# Altium project Thermostat_Thorlabs.PrjPCB (part 1 of 2)
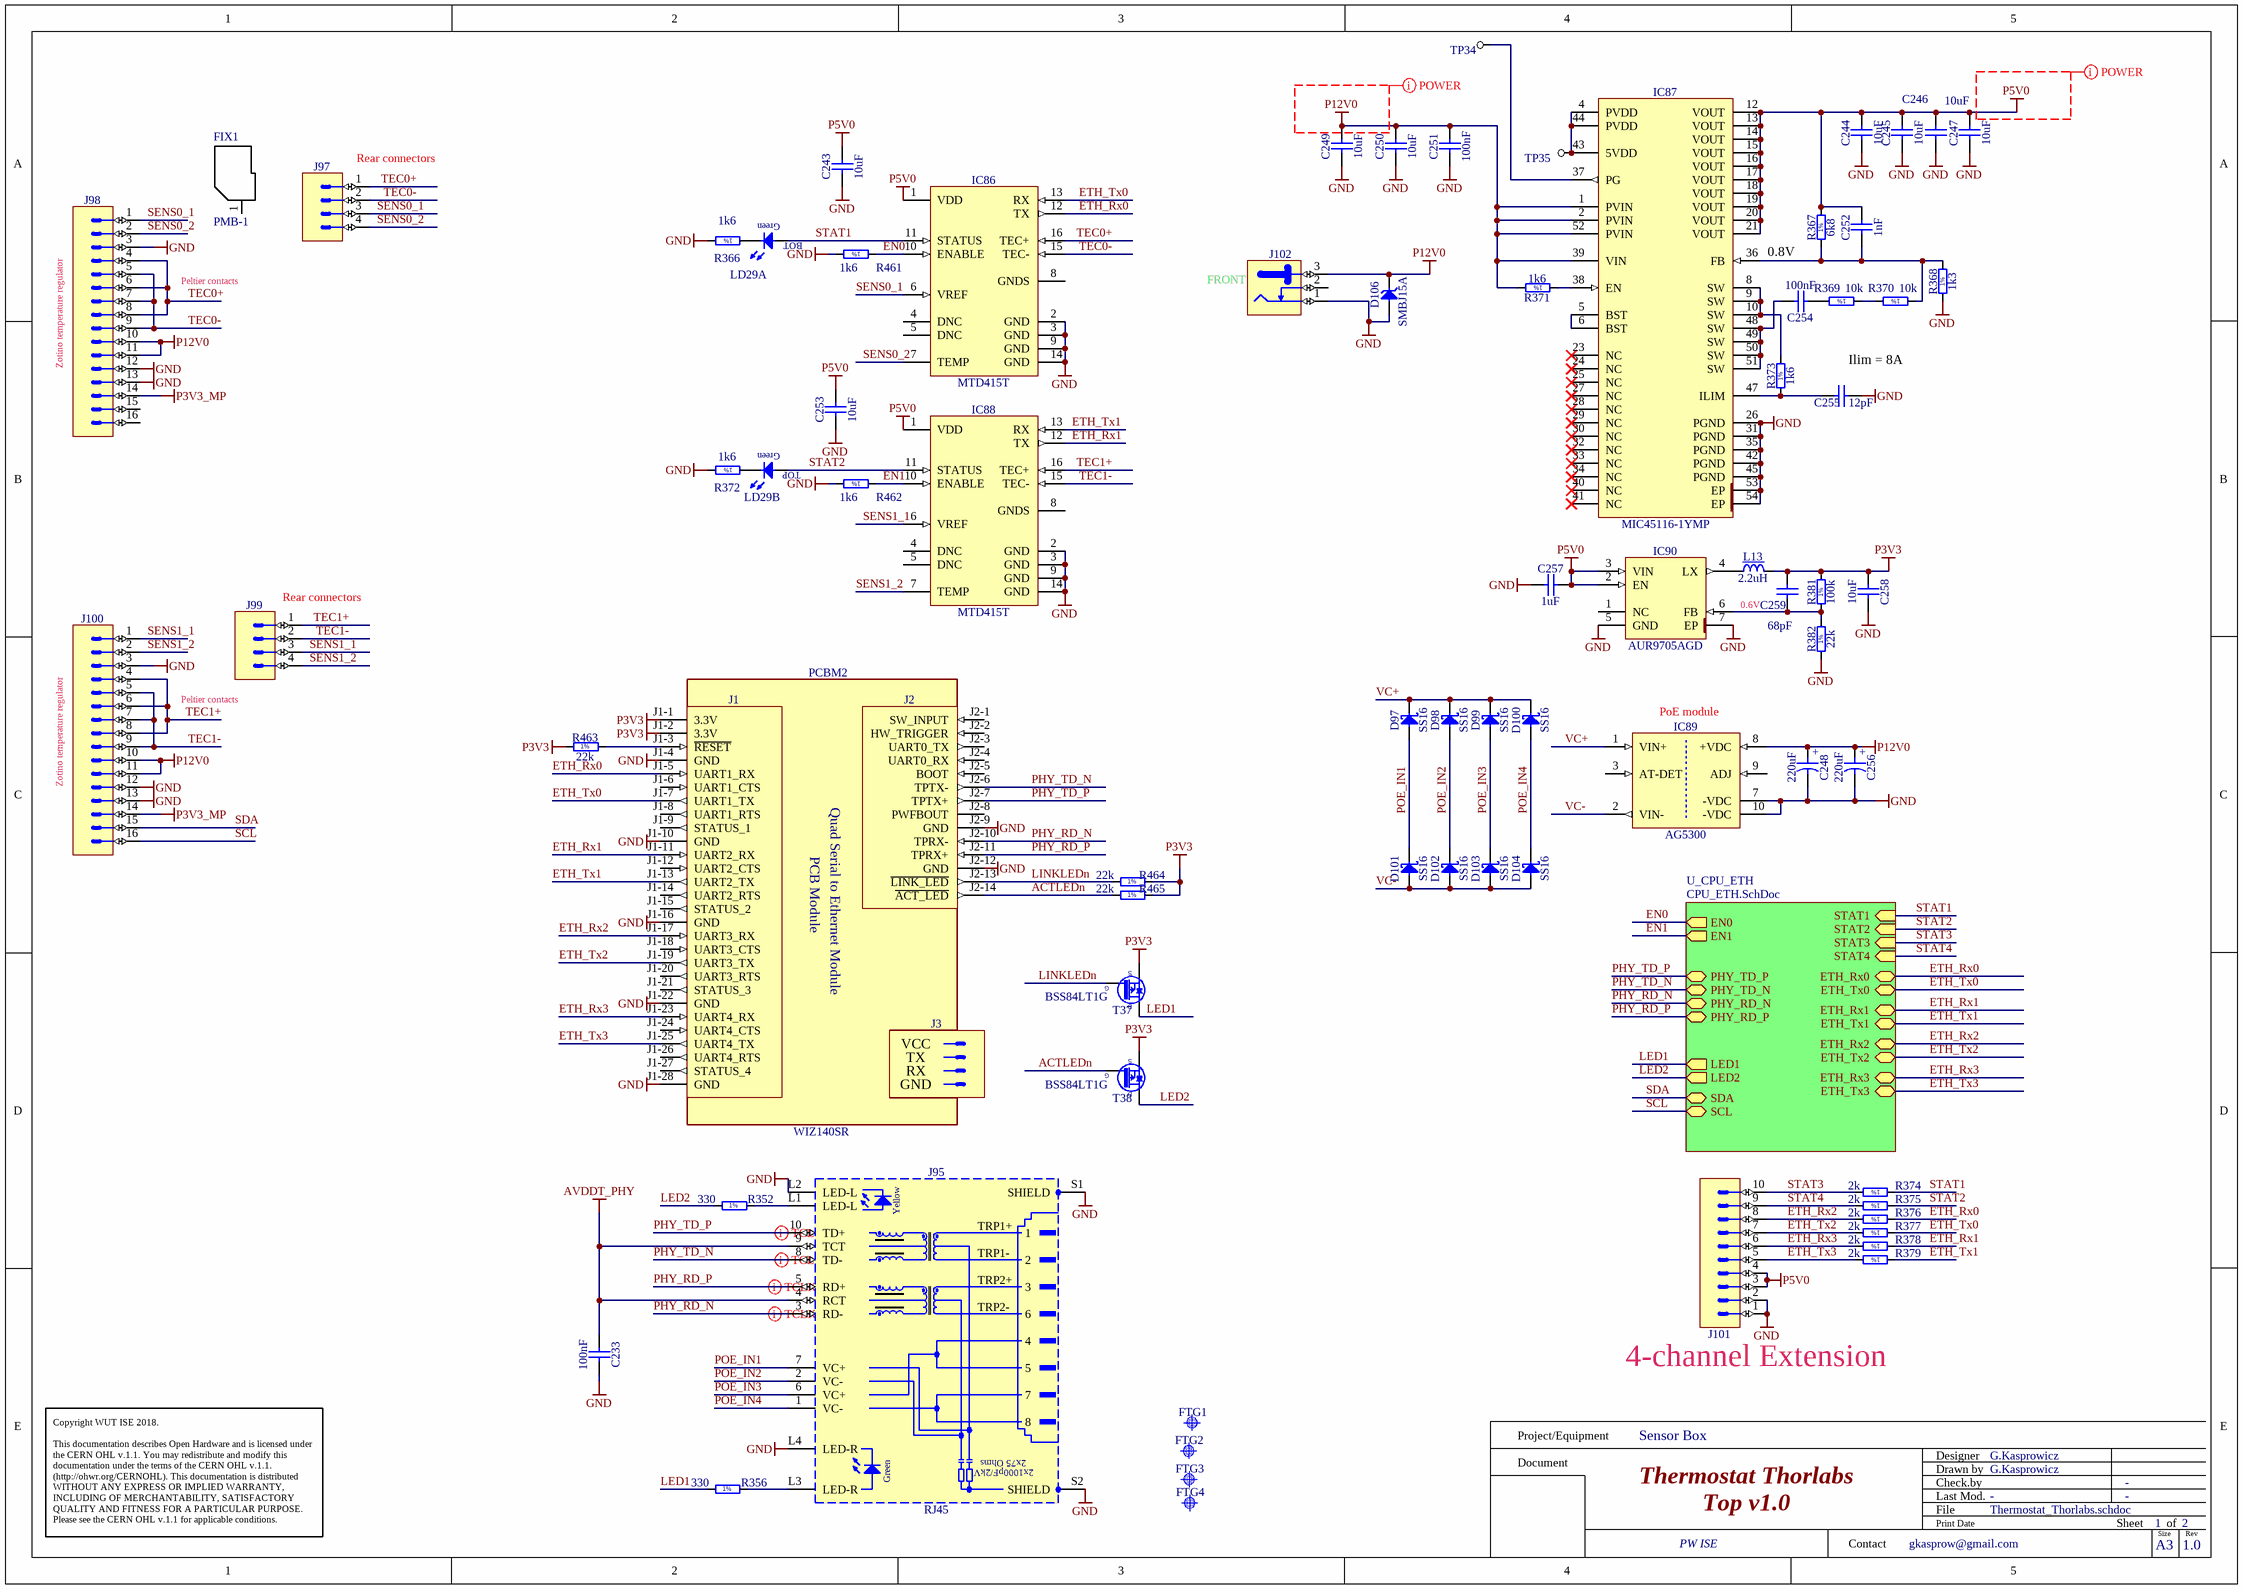
[diagram p0: Thermostat_Thorlabs.schdoc]
2 sheets, 131 parts. Net scope: hierarchical (ports join the sheet entries above them; power ports are global).
Board file: Thermostat_Thorlabs.PCBDOC
Sheets:
  Thermostat_Thorlabs.schdoc
    U_CPU_ETH = CPU_ETH.SchDoc

## Sheet Thermostat_Thorlabs.schdoc: Thermostat Thorlabs
size 420 x 297 mm; EDA_Number: ARTIQ; Projet: Thermostat; Author: G.Kasprowicz; CompanyName: WUT ISE; DrawnBy: G.Kasprowicz; Organization: WUT ISE; Address1: PW ISE; Address2: Nowowiejska 15/19 00-665 Warsaw; Address3: gkasprow@gmail.com; DocumentNumber: 1; Revision: 1.0; SheetNumber: 1; SheetTotal: 2; ModifiedBy: -; CheckedDate: -; Title2: Top v1.0; DivGrp: WUT ISE; Designer: G.Kasprowicz; ModifiedDate: -; ProjectName: Sensor Box

### Parts
C233  100nF  [CAPC1005X55N]
C243  10uF  [CAPC2012X135N]
C244  10uF  [CAPC2012X135N]
C245  10uF  [CAPC2012X135N]
C246  10uF  [CAPC2012X135N]
C247  10uF  [CAPC2012X135N]
C248  220uF  [CAPMP7343X430N]
C249  10uF  [CAPC2012X135N]
C250  10uF  [CAPC2012X135N]
C251  100nF  [CAPC1005X55N]
C252  1nF  [CAPC1608X87N]
C253  10uF  [CAPC2012X135N]
C254  100nF  [CAPC1005X55N]
C255  12pF  [CAPC1005X55N]
C256  220uF  [CAPMP7343X430N]
C257  1uF  [CAPC1005X55N]
C258  10uF  [CAPC2012X135N]
C259  68pF  [CAPC1608X87N]
D97  SS16  [DIOM5127X229N]
D98  SS16  [DIOM5127X229N]
D99  SS16  [DIOM5127X229N]
D100  SS16  [DIOM5127X229N]
D101  SS16  [DIOM5127X229N]
D102  SS16  [DIOM5127X229N]
D103  SS16  [DIOM5127X229N]
D104  SS16  [DIOM5127X229N]
D106  SMBJ15A  [DIOM5336X265N]
FIX1  PMB-1  [PMB-1]
FTG1  Use only in PCB  [FIDUCIAL_TOP_C100-200]  (value not drawn)
FTG2  Use only in PCB  [FIDUCIAL_TOP_S100-200]  (value not drawn)
FTG3  Use only in PCB  [FIDUCIAL_TOP_S200-400]  (value not drawn)
FTG4  Use only in PCB  [FIDUCIAL_TOP_S100-200]  (value not drawn)
IC86  MTD415T  [THORLABS_MTD415T]
IC87  MIC45116-1YMP  [MICROCHIP_H3QFN88-52LD-PL-3]
IC88  MTD415T  [THORLABS_MTD415T]
IC89  AG5300  [SILVERTEL_AG5300]
IC90  AUR9705AGD  [SON65P200X200X80-7N-R65X145]
J95  RJ45  [ABRACON_ARJM11C7-114-BA-EW2]
J97  (no value)  [FCI_20020110-D041A01LF]
J98  Header 16  [3M_N2516-6002RB]  (value not drawn)
J99  (no value)  [FCI_20020110-D041A01LF]
J100  Header 16  [3M_N2516-6002RB]  (value not drawn)
J101  Header 10  [3M_N2510-6002RB]  (value not drawn)
J102  Jack  [SWITCHCRAFT_L712RA]  (value not drawn)
L13  2.2uH  [IND_MURATA_LQH44PN_P0]
LD29  Green/Green  [LED_DIALIGHT_571-0122F]  (value not drawn)  (parts A,B of 2)
PCBM2  WIZ140SR  [PCBM_WIZNET_WIZ140SR_a]
R352  330  [RESC1005X40N]
R356  330  [RESC1005X40N]
R366  1k6  [RESC1005X40N]
R367  6k8  [RESC1005X40N]
R368  1k3  [RESC1608X55N]
R369  10k  [RESC1005X40N]
R370  10k  [RESC1005X40N]
R371  1k6  [RESC1005X40N]
R372  1k6  [RESC1005X40N]
R373  1k6  [RESC1005X40N]
R374  2k  [RESC1005X40N]
R375  2k  [RESC1005X40N]
R376  2k  [RESC1005X40N]
R377  2k  [RESC1005X40N]
R378  2k  [RESC1005X40N]
R379  2k  [RESC1005X40N]
R381  100k  [RESC1005X40N]
R382  22k  [RESC1005X40N]
R461  1k6  [RESC1005X40N]
R462  1k6  [RESC1005X40N]
R463  22k  [RESC1005X40N]
R464  22k  [RESC1005X40N]
R465  22k  [RESC1005X40N]
T37  BSS84LT1G  [SOT95P240X110-3N]
T38  BSS84LT1G  [SOT95P240X110-3N]
TP34  TP  [TP]  (value not drawn)
TP35  TP  [TP]  (value not drawn)

### Sub-sheets
U_CPU_ETH = CPU_ETH.SchDoc: PHY_TD_P (bidir), PHY_TD_N (bidir), PHY_RD_N (bidir), PHY_RD_P (bidir), STAT1 (in), STAT2 (in), ETH_Rx1 (bidir), ETH_Tx1 (bidir), ETH_Rx2 (bidir), ETH_Tx2 (bidir), ETH_Rx3 (bidir), ETH_Tx3 (bidir), STAT3 (in), STAT4 (in), LED1 (out), LED2 (out), EN0 (out), EN1 (out), SDA (bidir), SCL (bidir), ETH_Rx0 (bidir), ETH_Tx0 (bidir)

### Nets
AVDDT_PHY: C233.2 J95.4(RCT) J95.9(TCT)
GND: C233.1 C243.1 C244.1 C245.1 C246.1 C247.1 C248.2 C249.1 C250.1 C251.1 C253.1 C255.1 C256.2 C257.1 C258.2 D106.2(A) IC86.2(GND) IC86.3(GND) IC86.9(GND) IC86.14(GND) IC87.26(PGND) IC87.31(PGND) IC87.35(PGND) IC87.42(PGND) IC87.45(PGND) IC87.53(EP) IC87.54(EP) IC88.2(GND) IC88.3(GND) IC88.9(GND) IC88.14(GND) IC89.7(-VDC) IC89.10(-VDC) IC90.5(GND) IC90.7(EP) J95.L2(LED-L) J95.L4(LED-R) J95.S1(SHIELD) J95.S2(SHIELD) J98.3 J98.12 J98.13 J100.3 J100.12 J100.13 J101.1 J101.2 J102.1 PCBM2.J1-4(GND) PCBM2.J1-10(GND) PCBM2.J1-16(GND) PCBM2.J1-22(GND) PCBM2.J1-28(GND) PCBM2.J2-9(GND) PCBM2.J2-12(GND) R366.2 R368.1 R372.2 R382.1 R461.2 R462.2
P3V3: C258.1 C259.2 L13.2 PCBM2.J1-1(3.3V) PCBM2.J1-2(3.3V) R381.2 R463.1 R464.2 R465.2 T37.2(S) T38.2(S)
P3V3_MP: J98.14 J100.14
P5V0: C243.2 C244.2 C245.2 C246.2 C247.2 C252.2 C253.2 C257.2 IC86.1(VDD) IC87.12(VOUT) IC87.13(VOUT) IC87.14(VOUT) IC87.15(VOUT) IC87.16(VOUT) IC87.17(VOUT) IC87.18(VOUT) IC87.19(VOUT) IC87.20(VOUT) IC87.21(VOUT) IC88.1(VDD) IC90.2(EN) IC90.3(VIN) J101.3 J101.4 R367.2
P12V0: C248.1 C249.2 C250.2 C251.2 C256.1 D106.1(C) IC87.1(PVIN) IC87.2(PVIN) IC87.39(VIN) IC87.52(PVIN) IC89.8(+VDC) J98.10 J98.11 J100.10 J100.11 J102.3 R371.2
ACTLEDn: PCBM2.J2-14(~{ACT_LED}) R465.1 T38.1(G)
EN0: IC86.10(ENABLE) R461.1 ; sheet U_CPU_ETH/EN0
EN1: IC88.10(ENABLE) R462.1 ; sheet U_CPU_ETH/EN1
ETH_Rx0: IC86.12(TX) PCBM2.J1-5(UART1_RX) R376.1 ; sheet U_CPU_ETH/ETH_Rx0
ETH_Rx1: IC88.12(TX) PCBM2.J1-11(UART2_RX) R378.1 ; sheet U_CPU_ETH/ETH_Rx1
ETH_Rx2: J101.8 PCBM2.J1-17(UART3_RX) R376.2 ; sheet U_CPU_ETH/ETH_Rx2
ETH_Rx3: J101.6 PCBM2.J1-23(UART4_RX) R378.2 ; sheet U_CPU_ETH/ETH_Rx3
ETH_Tx0: IC86.13(RX) PCBM2.J1-7(UART1_TX) R377.1 ; sheet U_CPU_ETH/ETH_Tx0
ETH_Tx1: IC88.13(RX) PCBM2.J1-13(UART2_TX) R379.1 ; sheet U_CPU_ETH/ETH_Tx1
ETH_Tx2: J101.7 PCBM2.J1-19(UART3_TX) R377.2 ; sheet U_CPU_ETH/ETH_Tx2
ETH_Tx3: J101.5 PCBM2.J1-25(UART4_TX) R379.2 ; sheet U_CPU_ETH/ETH_Tx3
LED1: R356.1 T37.3(D) ; sheet U_CPU_ETH/LED1
LED2: R352.1 T38.3(D) ; sheet U_CPU_ETH/LED2
LINKLEDn: PCBM2.J2-13(~{LINK_LED}) R464.1 T37.1(G)
PHY_RD_N: J95.3(RD-) PCBM2.J2-10(TPRX-) ; sheet U_CPU_ETH/PHY_RD_N
PHY_RD_P: J95.5(RD+) PCBM2.J2-11(TPRX+) ; sheet U_CPU_ETH/PHY_RD_P
PHY_TD_N: J95.8(TD-) PCBM2.J2-6(TPTX-) ; sheet U_CPU_ETH/PHY_TD_N
PHY_TD_P: J95.10(TD+) PCBM2.J2-7(TPTX+) ; sheet U_CPU_ETH/PHY_TD_P
POE_IN1: D97.2(A) D101.1(C) J95.7(VC+)
POE_IN2: D98.2(A) D102.1(C) J95.2(VC-)
POE_IN3: D99.2(A) D103.1(C) J95.6(VC+)
POE_IN4: D100.2(A) D104.1(C) J95.1(VC-)
SCL: J100.16 ; sheet U_CPU_ETH/SCL
SDA: J100.15 ; sheet U_CPU_ETH/SDA
SENS0_1: IC86.6(VREF) J97.3 J98.1
SENS0_2: IC86.7(TEMP) J97.4 J98.2
SENS1_1: IC88.6(VREF) J99.3 J100.1
SENS1_2: IC88.7(TEMP) J99.4 J100.2
STAT1: IC86.11(STATUS) LD29.2(A) R374.1 ; sheet U_CPU_ETH/STAT1
STAT2: IC88.11(STATUS) LD29.4(A) R375.1 ; sheet U_CPU_ETH/STAT2
STAT3: J101.10 R374.2 ; sheet U_CPU_ETH/STAT3
STAT4: J101.9 R375.2 ; sheet U_CPU_ETH/STAT4
TEC0+: IC86.16(TEC+) J97.1 J98.4 J98.6 J98.8
TEC0-: IC86.15(TEC-) J97.2 J98.5 J98.7 J98.9
TEC1+: IC88.16(TEC+) J99.1 J100.4 J100.6 J100.8
TEC1-: IC88.15(TEC-) J99.2 J100.5 J100.7 J100.9
VC+: D97.1(C) D98.1(C) D99.1(C) D100.1(C) IC89.1(VIN+)
VC-: D101.2(A) D102.2(A) D103.2(A) D104.2(A) IC89.2(VIN-)
NetC252_1: C252.1 IC87.36(FB) R367.1 R368.2 R370.1
NetC254_1: C254.1 R369.2
NetC254_2: C254.2 IC87.48(SW) IC87.49(SW) IC87.50(SW) IC87.51(SW)
NetC255_2: C255.2 IC87.47(ILIM) R373.1
NetC259_1: C259.1 IC90.6(FB) R381.1 R382.2
NetIC87_4: IC87.4(PVDD) IC87.43(5VDD) IC87.44(PVDD) TP35.1
NetIC87_5: IC87.5(BST) IC87.6(BST)
NetIC87_8: IC87.8(SW) IC87.9(SW) IC87.10(SW) R373.2
NetIC87_37: IC87.37(PG) TP34.1
NetIC87_38: IC87.38(EN) R371.1
NetIC90_4: IC90.4(LX) L13.1
NetJ95_L1: J95.L1(LED-L) R352.2
NetJ95_L3: J95.L3(LED-R) R356.2
NetLD29_1: LD29.1(C) R366.1
NetLD29_3: LD29.3(C) R372.1
NetPCBM2_J1-3: PCBM2.J1-3(~{RESET}) R463.2
NetR369_1: R369.1 R370.2

Not connected (* = marked no-connect by the designer): FIX1 1; IC86 4(DNC) 5(DNC) 8(GNDS); IC87 23(NC)* 24(NC)* 25(NC)* 27(NC)* 28(NC)* 29(NC)* 30(NC)* 32(NC)* 33(NC)* 34(NC)* 40(NC)* 41(NC)*; IC88 4(DNC) 5(DNC) 8(GNDS); IC89 3(AT-DET) 9(ADJ); IC90 1(NC); J98 15 16; J102 2; PCBM2 J1-6(UART1_CTS) J1-8(UART1_RTS) J1-9(STATUS_1) J1-12(UART2_CTS) J1-14(UART2_RTS) J1-15(STATUS_2) J1-18(UART3_CTS) J1-20(UART3_RTS) J1-21(STATUS_3) J1-24(UART4_CTS) J1-26(UART4_RTS) J1-27(STATUS_4) J2-1(SW_INPUT) J2-2(HW_TRIGGER) J2-3(UART0_TX) J2-4(UART0_RX) J2-5(BOOT) J2-8(PWFBOUT)

### Layout directives
net class POWER: P5V0, P12V0
differential pair: PHY_RD_N, PHY_RD_P, PHY_TD_N, PHY_TD_P

### Notes on the sheet
- (near J97) Rear connectors
- 0.8V
- Peltier contacts
- FRONT
- (near J98) Zotino temperature regulator
- (near C255) Ilim = 8A
- (near J99) Rear connectors
- 0.6V
- (near J99) Peltier contacts
- (near IC89) PoE module
- (near J100) Zotino temperature regulator
- (near J101) 4-channel Extension
- Project/Equipment
- Document
- Designer
- Drawn by
- Check.by
- Copyright WUT ISE 2018.
  This documentation describes Open Hardware and is licensed under the CERN OHL v.1.1. You may redistribute and modify this documentation under the terms of the CERN OHL v.1.1. (http://ohwr.org/CERNOHL). This documentation is distributed WITHOUT ANY EXPRESS OR IMPLIED WARRANTY, INCLUDING OF MERCHANTABILITY, SATISFACTORY QUALITY AND FITNESS FOR A PARTICULAR PURPOSE. Please see the CERN OHL v.1.1 for applicable conditions.
- Contact
- File
- Last Mod.
- Print Date
- Sheet
- Size
- A3
- of
- Rev
- (in symbol CON_ETH_POE_ARJM11C7) Yellow; TRP1+; TRP1-; TRP2+; TRP2-; 2x75 Ohms; Green; 2x1000pF/2kV
- (in symbol CTE7343-43_220UF_16V_10%) +
- (in symbol LED_DIALIGHT_571-0122F, part A) Green; BOT
- (in symbol LED_DIALIGHT_571-0122F, part B) Green; TOP
- (in symbol PCBM_WIZNET_WIZ140SR_a) J1; J2; PCB Module; Quad Serial to Ethernet Module; J3; VCC; TX; RX
- (in symbol R0402_1K6_1%_0.0625W_100PPM) 1%
- (in symbol R0402_2K_1%_0.0625W_100PPM) 1%
- (in symbol R0402_6K8_1%_0.0625W_100PPM) 1%
- (in symbol R0402_10K_1%_0.0625W_100PPM) 1%
- (in symbol R0402_22K_1%_0.0625W_100PPM) 1%
- (in symbol R0402_100K_1%_0.0625W_100PPM) 1%
- (in symbol R0402_330R_1%_0.0625W_100PPM) 1%
- (in symbol R0603_1K3_1%_0.1W_100PPM) 1%

### Library data of the parts
C233 = CC0402_100NF_16V_10%_X5R: Non-polarised capacitor; Part Description: SMD Multilayer Chip Ceramic Capacitor; Manufacturer: GENERIC; Manufacturer1 Part Number: GRM155R61C104KA88D; Voltage: 16V; TC: X5R; Tolerance: ±10%; Part Number: CC0402_100NF_16V_10%_X5R; Component Kind: Standard; Component Type: Standard; Pin Count: 2; Value: 100nF; Status: None; Manufacturer Part Number: CC0402_100NF_16V_10%_X5R; Case: 0402; Mounted: Yes; Socket: No; SMD: Yes; Manufacturer1 Example: MURATA; Manufacturer1 ComponentHeight: 0.55mm; HelpURL: \\cern.ch\dfs\Applications\Altium\Datasheets\CC0402_X5R_MURATA_GRM.pdf; Author: CERN DEM JLC; CreateDate: 10.12.2013; LatestRevisionDate: 10.12.2013; Sense: No
C243-C247 C249 C250 C253 C258 = CC0805_10UF_16V_10%_X5R: Non-polarised capacitor; Part Description: SMD Multilayer Chip Ceramic Capacitor; Manufacturer: GENERIC; Manufacturer1 Part Number: C0805C106K4PAC; Voltage: 16V; TC: X5R; Tolerance: ±10%; Part Number: CC0805_10UF_16V_10%_X5R; Component Kind: Standard; Component Type: Standard; Pin Count: 2; Value: 10uF; Status: Preferred; Manufacturer Part Number: CC0805_10UF_16V_10%_X5R; Case: 0805; Mounted: Yes; Socket: No; SMD: Yes; Manufacturer1 Example: KEMET; Manufacturer1 ComponentHeight: 1.4mm; HelpURL: \\cern.ch\dfs\Applications\Altium\Datasheets\CC1206_X5R_KEMET.pdf; Author: CERN DEM JLC; CreateDate: 03.12.2007; LatestRevisionDate: 03.12.2007; Sense: No
C248 C256 = CTE7343-43_220UF_16V_10%: Polarised capacitor; Part Description: Solid Tantalum Chip Capacitor; Manufacturer: GENERIC; Manufacturer1 Part Number: TAJE227K016R; Voltage: 16V; Tolerance: ±10%; Part Number: CTE7343-43_220UF_16V_10%; Component Kind: Standard; Component Type: Standard; Pin Count: 2; Value: 220uF; Status: Preferred; Manufacturer Part Number: CTE7343-43_220UF_16V_10%; Case: E; Mounted: Yes; Socket: No; SMD: Yes; Sense: No; Manufacturer1 Example: AVX; Manufacturer1 ComponentHeight: 4.3mm; HelpURL: \\cern.ch\dfs\Applications\Altium\Datasheets\CTE_AVX_TAJ.pdf; Author: CERN DEM JLC; CreateDate: 03.12.2007; LatestRevisionDate: 03.12.2007
C251 C254 = CC0402_100NF_16V_10%_X5R: Non-polarised capacitor; Part Description: SMD Multilayer Chip Ceramic Capacitor; Manufacturer: GENERIC; Manufacturer1 Part Number: GRM155R61C104KA88D; Voltage: 16V; TC: X5R; Tolerance: ±10%; Table: Capacitors SMD; Part Number: CC0402_100NF_16V_10%_X5R; Component Kind: Standard; Component Type: Standard; Pin Count: 2; Value: 100nF; Status: None; Manufacturer Part Number: CC0402_100NF_16V_10%_X5R; Case: 0402; Mounted: Yes; Socket: No; SMD: Yes; Manufacturer1 Example: MURATA; Manufacturer1 ComponentHeight: 0.55mm; HelpURL: \\cern.ch\dfs\Applications\Altium\Datasheets\CC0402_X5R_MURATA_GRM.pdf; Author: CERN DEM JLC; CreateDate: 2013-12-10; LatestRevisionDate: 2013-12-10
C252 = CC0603_1NF_100V_10%_X7R: Non-polarised capacitor; Part Description: SMD Multilayer Chip Ceramic Capacitor; Manufacturer: GENERIC; Manufacturer1 Part Number: C0603C102K1RACTU; Voltage: 100V; TC: X7R; Tolerance: ±10%; Part Number: CC0603_1NF_100V_10%_X7R; Component Kind: Standard; Component Type: Standard; Pin Count: 2; Value: 1nF; Status: Preferred; Manufacturer Part Number: CC0603_1NF_100V_10%_X7R; Case: 0603; Mounted: Yes; Socket: No; SMD: Yes; Sense: No; Manufacturer1 Example: KEMET; Manufacturer1 ComponentHeight: 0.87mm; HelpURL: \\cern.ch\dfs\Applications\Altium\Datasheets\CC0603_X7R_KEMET.pdf; Author: CERN DEM JLC; CreateDate: 12.12.2013; LatestRevisionDate: 12.12.2013
C255 = CC0402_12PF_50V_5%_C0G: Non-polarised capacitor; Part Description: SMD Multilayer Chip Ceramic Capacitor; Manufacturer: GENERIC; Manufacturer1 Part Number: C0402C120J5GACTU; Voltage: 50V; TC: C0G/NP0; Tolerance: ±5%; Part Number: CC0402_12PF_50V_5%_C0G; Component Kind: Standard; Component Type: Standard; Pin Count: 2; Value: 12pF; Status: Preferred; Manufacturer Part Number: CC0402_12PF_50V_5%_C0G; Case: 0402; Mounted: Yes; Socket: No; SMD: Yes; Sense: No; Manufacturer1 Example: KEMET; Manufacturer1 ComponentHeight: 0.55mm; HelpURL: \\cern.ch\dfs\Applications\Altium\Datasheets\CC0805_C0G_KEMET_(Commercial Grade).pdf; Author: CERN DEM JLC; CreateDate: 04.10.2016; LatestRevisionDate: 04.10.2016
C257 = CC0402_1UF_16V_10%_X5R: Non-polarised capacitor; Part Description: SMD Multilayer Chip Ceramic Capacitor; Manufacturer: GENERIC; Manufacturer1 Part Number: C1005X5R1C105KT; Voltage: 16V; TC: X5R; Tolerance: ±10%; Part Number: CC0402_1UF_16V_10%_X5R; Component Kind: Standard; Component Type: Standard; Pin Count: 2; Value: 1uF; Status: Preferred; Manufacturer Part Number: CC0402_1UF_16V_10%_X5R; Case: 0402; Mounted: Yes; Socket: No; SMD: Yes; Sense: No; Manufacturer1 Example: TDK; Manufacturer1 ComponentHeight: 0.55mm; HelpURL: \\cern.ch\dfs\Applications\Altium\Datasheets\CC0402_X5R_TDK_C.pdf; Author: CERN DEM JLC; CreateDate: 25.10.2012; LatestRevisionDate: 25.10.2012
C259 = CC0603_68PF_50V_5%_NP0: Non-polarised capacitor; Part Description: SMD Multilayer Chip Ceramic Capacitor; Manufacturer: GENERIC; Manufacturer1 Part Number: 223886715689; Voltage: 50V; TC: C0G/NP0; Tolerance: ±5%; Part Number: CC0603_68PF_50V_5%_NP0; Component Kind: Standard; Component Type: Standard; Pin Count: 2; Value: 68pF; Status: Preferred; Manufacturer Part Number: CC0603_68PF_50V_5%_NP0; Case: 0603; Mounted: Yes; Socket: No; SMD: Yes; Sense: No; Manufacturer1 Example: PHYCOMP; Manufacturer1 ComponentHeight: 0.87mm; HelpURL: \\cern.ch\dfs\Applications\Altium\Datasheets\CC0603_NP0_PHYCOMP.pdf; Author: CERN DEM JLC; CreateDate: 03.12.2007; LatestRevisionDate: 03.12.2007
D97-D104 = SS16: Schottky Diode; Part Description: Surface Mount Schottky Barrier Rectifier; Manufacturer: VISHAY GENERAL SEMICONDUCTOR; Voltage: 60V; Power: 1A; PressFit: No; Bonding: No; Part Number: SS16; Component Kind: Standard; Component Type: Standard; Device: SS16; PackageDescription: DO-214-AC Molded Diode, Body 5.1x2.7mm, IPC Medium Density; Manufacturer Part Number: SS16; Pin Count: 2; Case: DO-214AC; Mounted: Yes; Socket: No; SMD: Yes; Sense: No; ComponentHeight: 2.29mm; HelpURL: \\cern.ch\dfs\Applications\Altium\Datasheets\SS16.pdf; Author: CERN DEM JLC; CreateDate: 15.07.2008; LatestRevisionDate: 23.08.2010
D106 = SMBJ15A: Zener Diode; Part Description: Uni-Directional Transient Voltage Suppressor Diode; Manufacturer: FAIRCHILD SEMICONDUCTOR; Voltage: 15V; Power: 600W; PressFit: No; Bonding: No; Part Number: SMBJ15A; Component Kind: Standard; Component Type: Standard; Device: SMBJ15A; PackageDescription: DO-214-AA/SMB Diode, Molded Body; 5.34mm L X 3.625mm W X 2.65mm H, IPC Medium Density; Manufacturer Part Number: SMBJ15A; Pin Count: 2; Case: DO-214AA; Mounted: Yes; Socket: No; SMD: Yes; Sense: No; ComponentHeight: 2.65mm; HelpURL: \\cern.ch\dfs\Applications\Altium\Datasheets\SMBJ.pdf; Author: CERN DEM JLC; CreateDate: 08.12.2008; LatestRevisionDate: 19.12.2011
FIX1 = MECH_PCB_FIX_RA: right angle PCB fixing
FTG1 = FIDUCIAL_TARGET_C100-200: Fiducial Target; Part Description: Round Fiducial Target, Top Layer, 1.0mm, Top Solder 2.0mm, Keepout =2.0mm; Mounted: No; Part Number: FIDUCIAL_TARGET_C100-200; Component Kind: Standard (No BOM); Component Type: Standard (No BOM); Pin Count: 1; Family: Fiducial; Socket: No; SMD: Yes; Sense: No; Status: None; ComponentHeight: 0mm; HelpURL: Undefined; Author: CERN DEM JLC; CreateDate: 09.02.2010; LatestRevisionDate: 04.04.2012; PackageDescription: Round Fiducial Target, Top Layer, 1.0mm, Top Solder 2.0mm, Keepout =2.0mm
FTG2 FTG4 = FIDUCIAL_TARGET_S100-200: Fiducial Target; Part Description: Square Fiducial Target, Top Layer, 1.0mm, Top Solder 2.0mm, Keepout =2.0mm; Mounted: No; Part Number: FIDUCIAL_TARGET_S100-200; Component Kind: Standard (No BOM); Component Type: Standard (No BOM); Pin Count: 1; Family: Fiducial; Socket: No; SMD: Yes; Sense: No; Status: None; ComponentHeight: 0mm; HelpURL: Undefined; Author: CERN DEM JLC; CreateDate: 09.02.2010; LatestRevisionDate: 04.04.2012; PackageDescription: Square Fiducial Target, Top Layer, 1.0mm, Top Solder 2.0mm, Keepout =2.0mm
FTG3 = FIDUCIAL_TARGET_S200-400: Fiducial Target; Part Description: Square Fiducial Target, Top Layer, 2.0mm, Top Solder 4.0mm, Keepout =4.0mm; Mounted: No; Part Number: FIDUCIAL_TARGET_S200-400; Component Kind: Standard (No BOM); Component Type: Standard (No BOM); Pin Count: 1; Family: Fiducial; Socket: No; SMD: Yes; Sense: No; Status: None; ComponentHeight: 0mm; HelpURL: Undefined; Author: CERN DEM JLC; CreateDate: 02.06.2008; LatestRevisionDate: 04.04.2012; PackageDescription: Square Fiducial Target, Top Layer, 2.0mm, Top Solder 4.0mm, Keepout =4.0mm
IC86 IC88 = MTD415T: Miniature Temperature Controller, ±1.5 A, Compatible with 10 kΩ Thermistor; Manufacturer: THORLABS; PressFit: No; Bonding: No; Part Number: MTD415T; Component Kind: Standard; Component Type: Standard; Device: MTD415T; PackageDescription: THORLABS MTD415T Case, 1.27mm pitch, 16 Pins, 21mm X 12.4mm X 3.10mm H Body; Part Description: Miniature Temperature Controller, ±1.5 A, Compatible with 10 kΩ Thermistor; Manufacturer Part Number: MTD415T; Pin Count: 16; Mounted: Yes; Socket: No; SMD: Yes; Sense: No; ComponentHeight: 3.1mm; Author: CERN DEM MR; HelpURL: \\cern.ch\dfs\Applications\Altium\Datasheets\MTD415T.pdf; ComponentLink1URL: \\cern.ch\dfs\Applications\Altium\Datasheets\MTD415T_Package.pdf; ComponentLink1Description: Package Drawing; CreateDate: 16.02.2018; LatestRevisionDate: 16.02.2018
IC87 = MIC45116-1YMP: 0.8V to 85% PVIN (4.75-19V), 6A Synchronous Step-Down Regulator Module; Manufacturer: MICROCHIP TECHNOLOGY; PressFit: No; Bonding: No; Part Number: MIC45116-1YMP; Component Kind: Standard; Component Type: Standard; Device: MIC45116-1YMP; PackageDescription: MICROCHIP_H3QFN88-52LD-PL-3, 0.50mm Pitch, Square, 52 Pin, 8mm L X 8mm W X 3mm H Body; Part Description: 0.8V to 85% PVIN (4.75-19V), 6A Synchronous Step-Down Regulator Module; Manufacturer Part Number: MIC45116-1YMP; Pin Count: 53; Mounted: Yes; Socket: No; SMD: Yes; Sense: No; ComponentHeight: 3mm; HelpURL: \\cern.ch\dfs\Applications\Altium\Datasheets\MIC45116-1YMP.pdf; Author: CERN DEM JMW; CreateDate: 15.08.2016; LatestRevisionDate: 15.08.2016
IC89 = AG5300: Power-over-Ethernet Plus (POE+) Module; Part Description: 12V 30W Power-over-Ethernet Plus (POE+); Manufacturer: SILVERTEL; PressFit: No; Bonding: No; Part Number: AG5300; Component Kind: Standard; Component Type: Standard; Device: AG5300; PackageDescription: Power-over-Ethernet Plus (POE+) Module, Body L 57.3mm x W 18mm x H 14mm; Manufacturer Part Number: AG5300; Pin Count: 10; Mounted: Yes; Socket: No; SMD: No; Sense: No; ComponentHeight: 14mm; HelpURL: \\cern.ch\dfs\Applications\Altium\Datasheets\AG5300.pdf; Author: CERN DEM JLC; CreateDate: 20.03.2018; LatestRevisionDate: 20.03.2018
IC90 = AUR9705AGD: 0V to 6V Input, 1A, 1.5MHz, Step-Down DC-DC Converter; Manufacturer: DIODES INCORPORATED; PressFit: No; Bonding: No; Part Number: AUR9705AGD; Component Kind: Standard; Component Type: Standard; Device: AUR9705AGD; PackageDescription: SON, 0.65mm Pitch, 6 Pin, 2.00mm W X 2.00mm L X 0.80mm H body (W/Thermal Tab 0.65mm X 1.45mm), IPC Medium Density; Part Description: 0V to 6V Input, 1A, 1.5MHz, Step-Down DC-DC Converter; Manufacturer Part Number: AUR9705AGD; Pin Count: 7; Case: SON6; Mounted: Yes; Socket: No; SMD: Yes; Sense: No; ComponentHeight: 0.8mm; HelpURL: \\cern.ch\dfs\Applications\Altium\Datasheets\AUR9705AGD.pdf; Author: CERN DEM MR; CreateDate: 15.02.2018; LatestRevisionDate: 15.02.2018
J95 = CON_ETH_POE_ARJM11C7: MagJack 10/100BaseT, PoE+, 1X1, OG/Y, -40 to 85*C, Tab Up, RoHS; Part Number: ARJM11C7-114-BA-EW2; Part Description: 1 Port, Orange Green/Yellow LEDs, RJ45 10/100BaseT, PoE, Ethernet MagJack® Connector Module; Manufacturer: Abracon; PressFit: No; Component Kind: Standard; Component Type: Standard; Pin Count: 18; Family: RJ45; Mounted: Yes; Socket: No; SMD: No; Sense: No; Status: None; Manufacturer Part Number: ARJM11C7-114-BA-EW2; ComponentHeight: 13.61mm; HelpURL: \\cern.ch\dfs\Applications\Altium\Datasheets\BELFUSE_0826-1X1T-GJ-F.pdf; Author: GK; CreateDate: 05.11.2012; LatestRevisionDate: 05.11.2012
J97 J99 = FCI_20020110-D041A01LF: Connector 4 Male; Part Description: 10A, 300V, 4 Positions, Pitch 3.81mm, Right Angled Terminal Block; Manufacturer: FCI; PressFit: No; Part Number: FCI_20020110-D041A01LF; Component Kind: Standard; Component Type: Standard; Pin Count: 4; Mounted: Yes; Socket: No; SMD: No; Sense: No; Status: None; Manufacturer Part Number: 20020110-D041A01LF; ComponentHeight: 7.5mm; HelpURL: \\cern.ch\dfs\Applications\Altium\Datasheets\FCI_20020110-D041A01LF.pdf; Author: CERN DEM JLC; CreateDate: 08.04.2014; LatestRevisionDate: 08.04.2014
J98 J100 = 3M_N2516-6002RB: Connector 16 Male; Part Description: 16 Contacts - Straight .100'' x .100'' Low Profile Four-Wall Header, 2500 Series; Manufacturer: 3M; PressFit: No; Part Number: 3M_N2516-6002RB; Component Kind: Standard; Component Type: Standard; Pin Count: 16; Family: Header 16; Mounted: Yes; Socket: No; SMD: No; Sense: No; Status: None; Manufacturer Part Number: N2516-6002RB; ComponentHeight: 10.03mm; HelpURL: \\cern.ch\dfs\Applications\Altium\Datasheets\3M_N2516-6002RB.pdf; Author: CERN DEM JLC; CreateDate: 11.02.2009; LatestRevisionDate: 11.08.2009
J101 = 3M_N2510-6002RB: Connector 10 Male; Part Description: 10 Contacts - Straight .100'' x .100'' Low Profile Four-Wall Header, 2500 Series; Manufacturer: 3M; PressFit: No; Part Number: 3M_N2510-6002RB; Component Kind: Standard; Component Type: Standard; Pin Count: 10; Family: Header 10; Mounted: Yes; Socket: No; SMD: No; Sense: No; Status: None; Manufacturer Part Number: N2510-6002RB; ComponentHeight: 10.03mm; HelpURL: \\cern.ch\dfs\Applications\Altium\Datasheets\3M_N2510-6002RB.pdf; Author: CERN DEM JLC; CreateDate: 11.02.2009; LatestRevisionDate: 11.08.2009
J102 = CON_DC_5A_THT_RA: 24V /3. 5A, 2.1mm Diameter Pin, SMD DC Power Supply Connector With  Break Contact; Part Number: SWITCHCRAFT_712RA; Part Description: 12V/5A, 2.5mm Diameter Pin, THT DC Power Supply Connector With  Break Contact; Manufacturer: SWITCHCRAFT; Manufacturer Part Number: 712RA; PressFit: No; Component Kind: Standard; Component Type: Standard; Footprint: SWITCHCRAFT_712RA; Pin Count: 3; Family: Jack; Mounted: Yes; Socket: No; SMD: No; Sense: No; Status: None; ComponentHeight: 11mm; HelpURL: \\cern.ch\dfs\Applications\Altium\Datasheets\LUMBERG_161314.pdf; Author: GK; CreateDate: 15.02.2011; LatestRevisionDate: 20.07.2011
L13 = IND_2.2UH_20%_MURATA_LQH44PN2R2MP0L: Inductor With Core; Part Description: Wire Wound Ferrite Inductor for Power Lines; Manufacturer: MURATA; Power: 1.8A; Resistance: 0R049; Tolerance: ±20%; Part Number: IND_2.2UH_20%_MURATA_LQH44PN2R2MP0L; Component Kind: Standard; Component Type: Standard; Pin Count: 2; Value: 2.2uH; Status: None; Manufacturer Part Number: LQH44PN2R2MP0L; Case: 4040; Mounted: Yes; Socket: No; SMD: Yes; Sense: No; ComponentHeight: 1.8mm; HelpURL: \\cern.ch\dfs\Applications\Altium\Datasheets\IND_MURATA_LQH44PN_P0.pdf; Author: CERN DEM JLC; CreateDate: 14.02.2018; LatestRevisionDate: 14.02.2018
LD29 = LED_DIALIGHT_571-0122F: LED x2 Green 1C2A-BOT_3C4A-TOP; Part Description: Dual 2mm Green LEDs CBI® Circuit Board Indicator (Without positioning pins); PressFit: No; Bonding: No; Part Number: LED_DIALIGHT_571-0122F; Component Kind: Standard; Component Type: Standard; Color: Green/Green; PackageDescription: 2x 2mm Red LED PCB Edge Mounting (Without positioning pins) DIALIGHT 571 Serie; Manufacturer: DIALIGHT; Manufacturer Part Number: 571-0122F; Pin Count: 4; Mounted: Yes; Socket: No; SMD: No; Sense: No; ComponentHeight: 8.6mm; HelpURL: \\cern.ch\dfs\Applications\Altium\Datasheets\LED_DIALIGHT_571-0122F.pdf; Author: CERN DEM JLC; CreateDate: 09.11.2009; LatestRevisionDate: 17.03.2010
PCBM2 = PCBM_WIZNET_WIZ140SR_a: Quad Serial to Ethernet Module Based on W5300 & Cortex-M3; Manufacturer: WIZNET; PressFit: No; Bonding: No; Part Number: PCBM_WIZNET_WIZ140SR_a; Component Kind: Standard; Component Type: Standard; Device: WIZ140SR; PackageDescription: Quad Serial to Ethernet Module Body 48.26mm x 35.56mm; Part Description: Quad Serial to Ethernet Module Based on W5300 & Cortex-M3; Manufacturer Part Number: WIZ140SR; Pin Count: 42; Mounted: Yes; Socket: No; SMD: No; Sense: No; ComponentHeight: 11.33mm; Author: CERN DEM JLC; HelpURL: \\cern.ch\dfs\Applications\Altium\Datasheets\PCBM_WIZNET_WIZ140SR.pdf; CreateDate: 26.03.2018; LatestRevisionDate: 26.03.2018
R352 R356 = R0402_330R_1%_0.0625W_100PPM: Resistor - 1%; Part Description: General Purpose Thick Film Chip Resistor; Manufacturer: GENERIC; Manufacturer1 Part Number: 232270673301L; TC: ±100ppm/°C; PressFit: No; Part Number: R0402_330R_1%_0.0625W_100PPM; Component Kind: Standard; Component Type: Standard; Pin Count: 2; Value: 330; Status: Not Recommended; Power: 0.0625W; Tolerance: ±1%; Manufacturer Part Number: R0402_330R_1%_0.0625W_100PPM; Case: 0402; Mounted: Yes; Sense: No; Socket: No; SMD: Yes; Manufacturer1 Example: YAGEO PHYCOMP; Manufacturer1 ComponentHeight: 0.4mm; HelpURL: \\cern.ch\dfs\Applications\Altium\Datasheets\R0402_Phycomp_RC0402.pdf; Author: CERN DEM JLC; CreateDate: 03.12.2007; LatestRevisionDate: 17.10.2012
R366 R371-R373 R461 R462 = R0402_1K6_1%_0.0625W_100PPM: Resistor - 1%; Part Description: General Purpose Thick Film Chip Resistor; Manufacturer: GENERIC; Manufacturer1 Part Number: 232270671602L; TC: ±100ppm/°C; PressFit: No; Part Number: R0402_1K6_1%_0.0625W_100PPM; Component Kind: Standard; Component Type: Standard; Pin Count: 2; Value: 1k6; Status: Not Recommended; Power: 0.0625W; Tolerance: ±1%; Manufacturer Part Number: R0402_1K6_1%_0.0625W_100PPM; Case: 0402; Mounted: Yes; Sense: No; Socket: No; SMD: Yes; Manufacturer1 Example: YAGEO PHYCOMP; Manufacturer1 ComponentHeight: 0.4mm; HelpURL: \\cern.ch\dfs\Applications\Altium\Datasheets\R0402_Phycomp_RC0402.pdf; Author: CERN DEM JLC; CreateDate: 03.12.2007; LatestRevisionDate: 17.10.2012
R367 = R0402_6K8_1%_0.0625W_100PPM: Resistor - 1%; Part Description: General Purpose Thick Film Chip Resistor; Manufacturer: GENERIC; Manufacturer1 Part Number: 232270676802L; TC: ±100ppm/°C; PressFit: No; Part Number: R0402_6K8_1%_0.0625W_100PPM; Component Kind: Standard; Component Type: Standard; Pin Count: 2; Value: 6k8; Status: Not Recommended; Power: 0.0625W; Tolerance: ±1%; Manufacturer Part Number: R0402_6K8_1%_0.0625W_100PPM; Case: 0402; Mounted: Yes; Sense: No; Socket: No; SMD: Yes; Manufacturer1 Example: YAGEO PHYCOMP; Manufacturer1 ComponentHeight: 0.4mm; HelpURL: \\cern.ch\dfs\Applications\Altium\Datasheets\R0402_Phycomp_RC0402.pdf; Author: CERN DEM JLC; CreateDate: 03.12.2007; LatestRevisionDate: 17.10.2012
R368 = R0603_1K3_1%_0.1W_100PPM: Resistor - 1%; Part Description: General Purpose Thick Film Chip Resistor; Manufacturer: GENERIC; Manufacturer1 Part Number: NRC06F1301TRF; Power: 0.1W; TC: ±100ppm/°C; PressFit: No; Part Number: R0603_1K3_1%_0.1W_100PPM; Component Kind: Standard; Component Type: Standard; Pin Count: 2; Value: 1k3; Status: Preferred; Tolerance: ±1%; Manufacturer Part Number: R0603_1K3_1%_0.1W_100PPM; Case: 0603; Mounted: Yes; Sense: No; Socket: No; SMD: Yes; Manufacturer1 Example: NIC COMPONENT; Manufacturer1 ComponentHeight: 0.55mm; HelpURL: \\cern.ch\dfs\Applications\Altium\Datasheets\R0603_NIC_NRC.pdf; Author: CERN DEM JLC; CreateDate: 03.12.2007; LatestRevisionDate: 13.03.2008
R369 R370 = R0402_10K_1%_0.0625W_100PPM: Resistor - 1%; Part Description: General Purpose Thick Film Chip Resistor; Manufacturer: GENERIC; Manufacturer1 Part Number: 232270671003L; TC: ±100ppm/°C; Table: Resistors SMD; Part Number: R0402_10K_1%_0.0625W_100PPM; Component Kind: Standard; Component Type: Standard; Pin Count: 2; Value: 10k; Status: Not recommended; Power: 0.0625W; Tolerance: ±1%; Manufacturer Part Number: R0402_10K_1%_0.0625W_100PPM; Case: 0402; Mounted: Yes; Socket: No; SMD: Yes; Manufacturer1 Example: YAGEO PHYCOMP; Manufacturer1 ComponentHeight: 0.4mm; HelpURL: \\cern.ch\dfs\Applications\Altium\Datasheets\R0402_Phycomp_RC0402.pdf; Author: CERN DEM JLC; CreateDate: 2007-12-03; LatestRevisionDate: 2012-10-17
R374-R379 = R0402_2K_1%_0.0625W_100PPM: Resistor - 1%; Part Description: General Purpose Thick Film Chip Resistor; Manufacturer: GENERIC; Manufacturer1 Part Number: 232270672002L; TC: ±100ppm/°C; PressFit: No; Part Number: R0402_2K_1%_0.0625W_100PPM; Component Kind: Standard; Component Type: Standard; Pin Count: 2; Value: 2k; Status: Not Recommended; Power: 0.0625W; Tolerance: ±1%; Manufacturer Part Number: R0402_2K_1%_0.0625W_100PPM; Case: 0402; Mounted: Yes; Socket: No; SMD: Yes; Manufacturer1 Example: YAGEO PHYCOMP; Manufacturer1 ComponentHeight: 0.4mm; HelpURL: \\cern.ch\dfs\Applications\Altium\Datasheets\R0402_Phycomp_RC0402.pdf; Author: CERN DEM JLC; CreateDate: 03.12.2007; LatestRevisionDate: 17.10.2012; Sense: No
R381 = R0402_100K_1%_0.0625W_100PPM: Resistor - 1%; Part Description: General Purpose Thick Film Chip Resistor; Manufacturer: GENERIC; Manufacturer1 Part Number: 232270671004L; TC: ±100ppm/°C; PressFit: No; Part Number: R0402_100K_1%_0.0625W_100PPM; Component Kind: Standard; Component Type: Standard; Pin Count: 2; Value: 100k; Status: Not Recommended; Power: 0.0625W; Tolerance: ±1%; Manufacturer Part Number: R0402_100K_1%_0.0625W_100PPM; Case: 0402; Mounted: Yes; Sense: No; Socket: No; SMD: Yes; Manufacturer1 Example: YAGEO PHYCOMP; Manufacturer1 ComponentHeight: 0.4mm; HelpURL: \\cern.ch\dfs\Applications\Altium\Datasheets\R0402_Phycomp_RC0402.pdf; Author: CERN DEM JLC; CreateDate: 03.12.2007; LatestRevisionDate: 17.10.2012
R382 R463-R465 = R0402_22K_1%_0.0625W_100PPM: Resistor - 1%; Part Description: General Purpose Thick Film Chip Resistor; Manufacturer: GENERIC; Manufacturer1 Part Number: 232270672203L; TC: ±100ppm/°C; PressFit: No; Part Number: R0402_22K_1%_0.0625W_100PPM; Component Kind: Standard; Component Type: Standard; Pin Count: 2; Value: 22k; Status: Not Recommended; Power: 0.0625W; Tolerance: ±1%; Manufacturer Part Number: R0402_22K_1%_0.0625W_100PPM; Case: 0402; Mounted: Yes; Sense: No; Socket: No; SMD: Yes; Manufacturer1 Example: YAGEO PHYCOMP; Manufacturer1 ComponentHeight: 0.4mm; HelpURL: \\cern.ch\dfs\Applications\Altium\Datasheets\R0402_Phycomp_RC0402.pdf; Author: CERN DEM JLC; CreateDate: 03.12.2007; LatestRevisionDate: 17.10.2012
T37 T38 = BSS84LT1G: P-CHANNEL MOSFET WITH DIODE; Part Description: 50V 130mA Single P-Channel Power MOSFET; Manufacturer: ON SEMICONDUCTOR; PressFit: No; Bonding: No; Part Number: BSS84LT1G; Component Kind: Standard; Component Type: Standard; Device: BSS84LT1G; PackageDescription: SOT23 3-Leads, Pitch 0.95mm - Body 1.4x3mm, IPC Medium Density; Manufacturer Part Number: BSS84LT1G; Pin Count: 3; Case: SOT23-3; Mounted: Yes; Socket: No; SMD: Yes; Sense: No; ComponentHeight: 1.1mm; HelpURL: \\cern.ch\dfs\Applications\Altium\Datasheets\BSS84LT1G.pdf; Author: CERN DEM JLC; CreateDate: 29.03.2012; LatestRevisionDate: 29.03.2012
TP34 TP35 = TP: Testpoint